# EAGLE schematic gbc_pcb_empty (EAGLE 9.5.2)
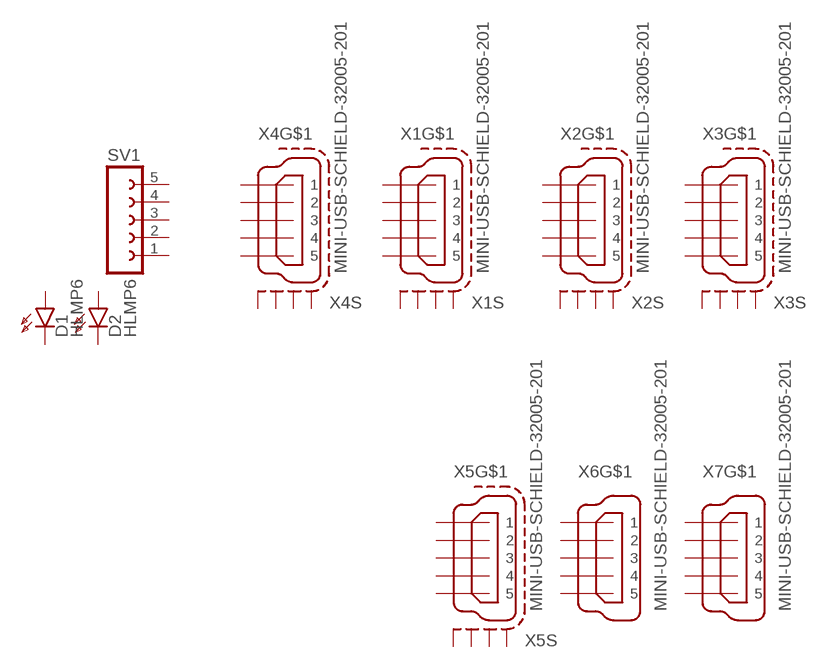
[diagram p0: schematic, sheet 1]

## Parts
D1  HLMP6  [HLMP6]
D2  HLMP6  [HLMP6]
SV1  FE05-1  [FE05-1]
X1  MINI-USB-SCHIELD-32005-201  [32005-201]
X2  MINI-USB-SCHIELD-32005-201  [32005-201]
X3  MINI-USB-SCHIELD-32005-201  [32005-201]
X4  MINI-USB-SCHIELD-32005-201  [32005-201]
X5  MINI-USB-SCHIELD-32005-201  [32005-201]
X6  MINI-USB-SCHIELD-32005-201  [32005-201]
X7  MINI-USB-SCHIELD-32005-201  [32005-201]
Unconnected: D1.A D1.K D2.A D2.K SV1.1 SV1.2 SV1.3 SV1.4 SV1.5 X1.1 X1.2 X1.3 X1.4 X1.5 X1.M1(S:S1) X1.M2(S:S2) X1.M3(S:S3) X1.M4(S:S4) X2.1 X2.2 X2.3 X2.4 X2.5 X2.M1(S:S1) X2.M2(S:S2) X2.M3(S:S3) X2.M4(S:S4) X3.1 X3.2 X3.3 X3.4 X3.5 X3.M1(S:S1) X3.M2(S:S2) X3.M3(S:S3) X3.M4(S:S4) X4.1 X4.2 X4.3 X4.4 X4.5 X4.M1(S:S1) X4.M2(S:S2) X4.M3(S:S3) X4.M4(S:S4) X5.1 X5.2 X5.3 X5.4 X5.5 X5.M1(S:S1) X5.M2(S:S2) X5.M3(S:S3) X5.M4(S:S4) X6.1 X6.2 X6.3 X6.4 X6.5 X6.M1(S:S1) X6.M2(S:S2) X6.M3(S:S3) X6.M4(S:S4) X7.1 X7.2 X7.3 X7.4 X7.5 X7.M1(S:S1) X7.M2(S:S2) X7.M3(S:S3) X7.M4(S:S4)

## Library data of the parts
D1 D2 = display-hp:HLMP6: LED 2mm horizontal; MF: AGILENT TECHNOLOGIES; MPN: HLMP-6500; OC_FARNELL: 1652490; OC_NEWARK: 40K0088
SV1 = con-lsta:FE05-1: FEMALE HEADER; OC_FARNELL: unknown; OC_NEWARK: unknown
X1-X7 = con-cypressindustries:MINI-USB-SCHIELD-: MINI USB-B Conector Source: www.cypressindustries.com; OC_FARNELL: unknown; OC_NEWARK: unknown